# Altium schematic sheet FAN_IF.SchDoc
size A4; SheetNumber: 9; SheetTotal: 19
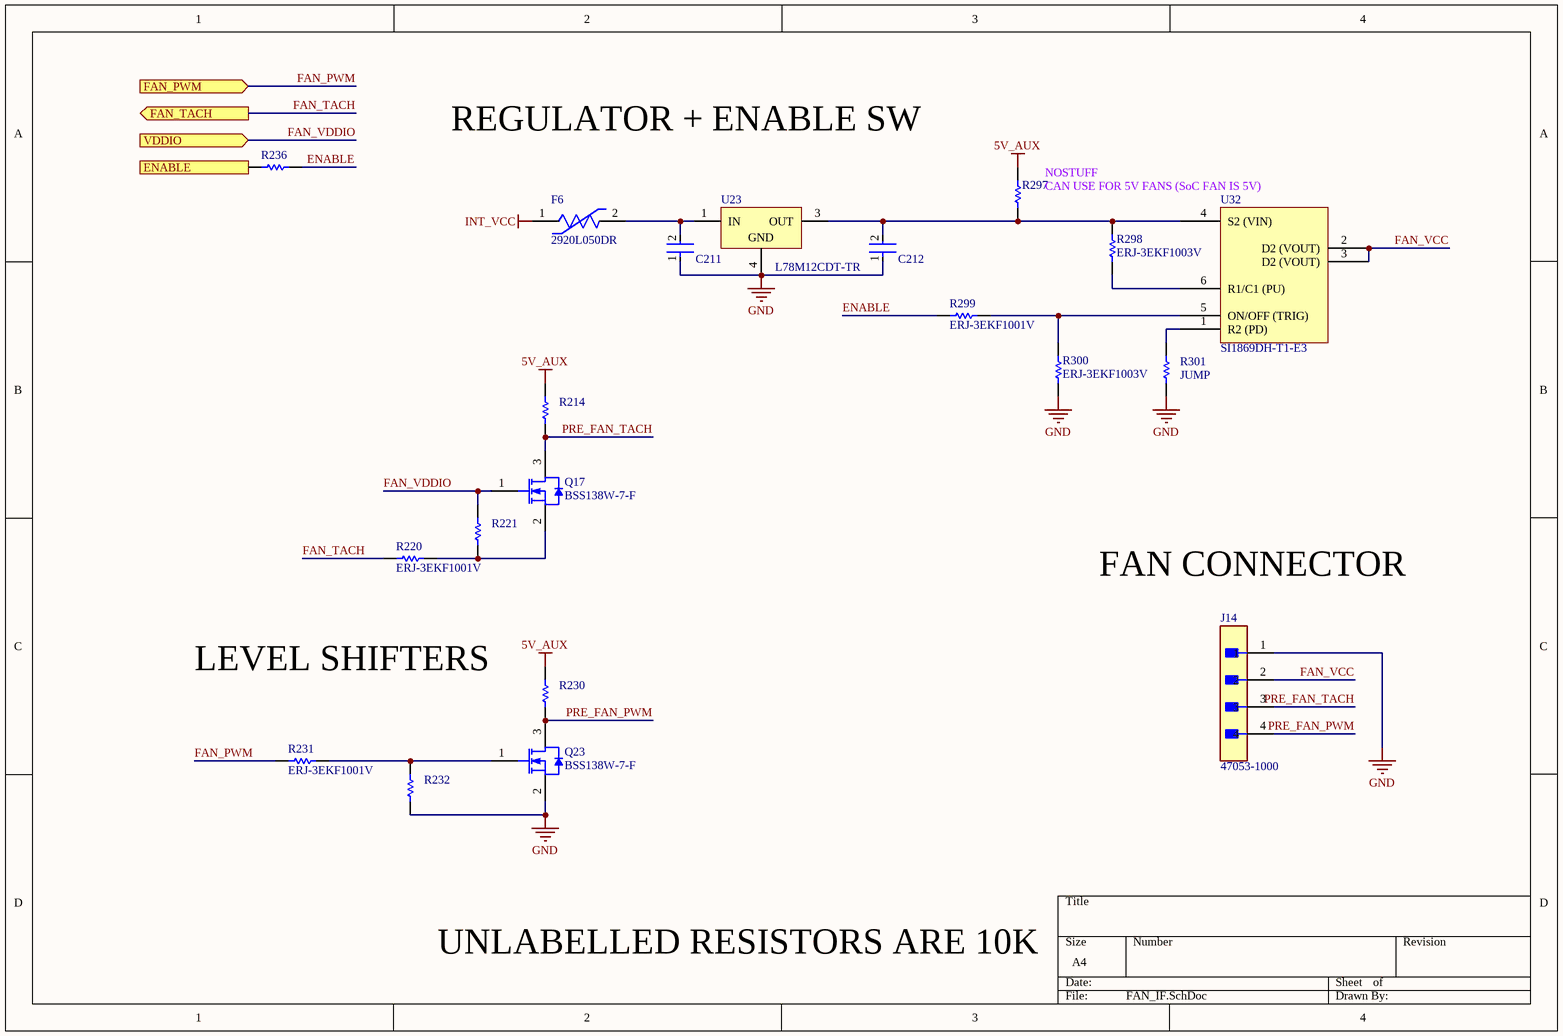
[diagram p0: FAN_IF.SchDoc]

## Parts
C211  C1005X7R1H104K050BB  [FP-C1005-050-0_05-IPC_C]  (value not drawn)
C212  C1005X7R1H104K050BB  [FP-C1005-050-0_05-IPC_C]  (value not drawn)
F6  2920L050DR  [FP-2920L050DR-MFG]
J14  47053-1000  [FP-470531000-MFG]
Q17  BSS138W-7-F  [DIOD-SOT323-3_V]
Q23  BSS138W-7-F  [DIOD-SOT323-3_V]
R214  ERJ3EKF1002V  [RESC1609X55X30LL15T15]  (value not drawn)
R220  ERJ-3EKF1001V  [RESC1608X55X30LL15T15]
R221  ERJ3EKF1002V  [RESC1609X55X30LL15T15]  (value not drawn)
R230  ERJ3EKF1002V  [RESC1609X55X30LL15T15]  (value not drawn)
R231  ERJ-3EKF1001V  [RESC1608X55X30LL15T15]
R232  ERJ3EKF1002V  [RESC1609X55X30LL15T15]  (value not drawn)
R236  0402 JUMPER  [RESC1005X40X25ML05T05]  (value not drawn)
R297  0402 JUMPER  [RESC1005X40X25ML05T05]  (value not drawn)
R298  ERJ-3EKF1003V  [RESC1608X55X30ML15T15]
R299  ERJ-3EKF1001V  [RESC1608X55X30LL15T15]
R300  ERJ-3EKF1003V  [RESC1608X55X30ML15T15]
R301  JUMP  [RESC1005X40X25ML05T05]
U23  L78M12CDT-TR  [TO-252_L]
U32  SI1869DH-T1-E3  [SOT65P242X110-6N]

## Ports
ENABLE (in, see VISION_BETA_EBB[4D]), FAN_PWM (in, see VISION_BETA_EBB[4D], STM32H730_PINOUT[8A]), FAN_TACH (out, see VISION_BETA_EBB[4D], STM32H730_PINOUT[8A]), VDDIO (in, see VISION_BETA_EBB[4D])

## Nets
5V_AUX: R214.1 R230.1 R297.2
GND: C211.1 C212.1 J14.1 Q23.2(S) R232.2 R300.1 R301.2 U23.4(GND)
INT_VCC: F6.1
ENABLE: R236.2 R299.1
ENABLE: R236.1 ; port ENABLE  [a separate net that carries the same name]
FAN_PWM: R231.1 ; port FAN_PWM
FAN_TACH: R220.1 ; port FAN_TACH
FAN_VCC: J14.2 U32.2(D2_(VOUT)) U32.3(D2_(VOUT))
FAN_VDDIO: Q17.1(G) R221.1 ; port VDDIO
PRE_FAN_PWM: J14.4 Q23.3(D) R230.2
PRE_FAN_TACH: J14.3 Q17.3(D) R214.2
NetC211_2: C211.2 F6.2 U23.1(IN)
NetC212_2: C212.2 R297.1 R298.2 U23.3(OUT) U32.4(S2_(VIN))
NetQ17_2: Q17.2(S) R220.2 R221.2
NetQ23_1: Q23.1(G) R231.2 R232.1
NetR298_1: R298.1 U32.6(R1/C1_(PU))
NetR299_2: R299.2 R300.2 U32.5(ON/OFF_(TRIG))
NetR301_1: R301.1 U32.1(R2_(PD))

## Notes on the sheet
- REGULATOR + ENABLE SW
- (near R297) NOSTUFF
- CAN USE FOR 5V FANS (SoC FAN IS 5V)
- FAN CONNECTOR
- LEVEL SHIFTERS
- UNLABELLED RESISTORS ARE 10K

## Library data of the parts
C211 C212 = CMP-2000-05393-2: Multilayer Ceramic Capacitors 100nF ±10% 50V X7R SMD 0402; Voltage: 50V; Dielectric Material: Ceramic; Min Operating Temperature: -55°C; Depth: 0.5mm; Radiation Hardening: No; RoHS Compliant: Yes; Voltage Rating (DC): 50V; Lead Free: Lead Free; Resistor Type: Ceramic; Height: 0.5mm; Dielectric: X7R; Thickness: 0.022inch; Case/Package: 0402; Case Code (Metric): 1005; Termination: SMD/SMT; Capacitance: 100nF; Packaging: Tape and Reel; Max Operating Temperature: 125°C; Mount: Surface Mount; Package Quantity: 1; Width: 0.02inch; Weight: 2.3E-05oz; Voltage Rating: 50V; Tolerance: 10%; Construction: Flat; Case Code (Imperial): 0402; Length: 1mm; REACH SVHC: No SVHC; Series: C
F6 = CMP-08606-000071-1: PTC RESET FUSE 60V 500MA 2920; Resistance: 1.4R; Trip Current: 1A; Power Dissipation: 1.5W; Time to Trip: 4s; Approvals: cULus; Current Rating: 10A; Operating Supply Voltage: 60V; Termination: SMD/SMT; Width: 5.44mm; Case/Package: 2920; Series: 2920L; Case Code (Imperial): 2920; Height: 1.25mm; Hold Current: 500mA; Terminal Material: Copper; Min Operating Temperature: -40°C; Package Quantity: 1500; Max Voltage Rating (DC): 60V; RoHS Compliant: Yes; Case Code (Metric): 7351; Lead Free: Lead Free; Max Operating Temperature: 85°C; Voltage Rating (DC): 60V; Working Voltage: 60V; Length: 7.98mm; REACH SVHC: No SVHC; Max Current Rating: 10A; Voltage Rating: 60V; Packaging: Tape and Reel
J14 = CMP-04776-000290-2: CONN HEADER VERT 4POS 2.54MM; NexarPartId: 854935; Manufacturer Lifecycle Status: ACTIVE; Voltage Rating (DC): 250V; Gender: Male; Plating: Copper; Number of Positions: 4; Glow Wire Compliant: Non-compliant; Current Rating: 500mA; Max Operating Temperature: 75°C; Number of Rows: 1; REACH SVHC: Unknown; Ambient Temperature Range High: 105°C; Pitch: 2.54mm; Height: 7.7mm; Min Operating Temperature: 0°C; Packaging: Bulk; Contact Material: Brass, Copper; Contact Plating: Tin; Lead Pitch: 2.54mm; Voltage Rating: 250V; Termination: Through Hole; Radiation Hardening: No; Orientation: Vertical; Mount: Through Hole; Number of Pins: 4; Country of Origin: HK; Halogen Free: Low Halogen; Lifecycle Status: Production; Number of Circuits: 4; Schedule B: 8536694040, 8536694040; Housing Color: Beige; Housing Material: Nylon; Depth: 5.84mm; RoHS: Compliant; Length: 10.2mm; Number of Contacts: 4
Q17 Q23 = CMP-2000-05968-1: N-Channel Enhancement Mode Mosfet, 50 V, 200 mA, -55 to 150 degC, 6-Pin SOT-323, RoHS, Tape and Reel; Typical Turn-Off Delay Time: 20ns; Number of Channels: 1Channel; Type: EnhancementModeFieldEffectTransistor; Brand: DiodesIncorporated; Vds - Drain-Source Breakdown Voltage: 75V; Vgs - Gate-Source Voltage: 20V; Rds On - Drain-Source Resistance: 1.4Ohms; Transistor Type: 1N-Channel; Configuration: Single; Unit Weight: 0.000212oz; Pd - Power Dissipation: 200mW; Id - Continuous Drain Current: 200mA; Forward Transconductance - Min: 0.1S; Manufacturer URL: http://www.diodes.com/; Series: BSS138; Package Description: 3-Pin Small Outline Transistor, Body 2 x 1.25 mm, Pitch 0.65 mm; Mounting Technology: SurfaceMount; Product Category: MOSFET; RoHS: True; Maximum Operating Temperature: +150C; Height: 1mm; Length: 2.2mm; Technology: Si; Width: 1.35mm; Datasheet URL: http://www.diodes.com/_files/datasheets/ds30206.pdf; Manufacturer: DiodesIncorporated; Package / Case: SOT-323-3; Typical Turn-On Delay Time: 20ns; Transistor Polarity: N-Channel; Factory Pack Quantity: 3000; Packaging: Reel; Product: MOSFETSmallSignal; Datasheet Version: Rev. 11-2, 09/2013; Package Reference: SOT323; Minimum Operating Temperature: -55C; Mounting Style: SMD/SMT; Channel Mode: Enhancement
R214 R221 R230 R232 = CMP-1012-00623-3: Chip Resistor, 10 KOhm, +/- 1%, 0.1 W, -55 to 155 degC, 0603 (1608 Metric), RoHS, Tape and Reel; Manufacturer: Panasonic; Voltage Rating: 75V; Case\/Package: 0603; Power Rating: 100mW; Resistance: 10KOhm; Temperature Coefficient: 100ppm\/degreesC; Number of Pins: 2; Package Reference: 603; Depth: 0.8mm; Mount: SurfaceMount; Package Description: 2-Pin Surface Mount Device, Body 1.6 x 0.85 mm; Datasheet Version: 02/2017; Length: 1.6mm; Lead Free: LeadFree; Height: 0.45mm; Number of Terminations: 2; Max Power Dissipation: 100mW; Min Operating Temperature: -55degC; Datasheet URL: https://industrial.panasonic.com/cdbs/www-data/pdf/RDA0000/AOA0000C304.pdf; Termination: SMD/SMT; Case Code (Metric): 1608; Case Code (Imperial): 0603; Tolerance: 1%; Max Operating Temperature: 155degC; RoHSCompliant: true; Voltage Rating (DC): 75V; Radiation Hardening: No; Packaging: TapeandReel; Composition: ThickFilm; Mounting Technology: SurfaceMount; Manufacturer URL: http://www.panasonic.com/; Width: 0.031inch; REACH SVHC: NoSVHC; Contact Plating: Tin; Military Standard: Not; Package Quantity: 1
R220 R231 R299 = CMP-2000-00180-1: Manufacturer: Panasonic; Part Number: ERJ-3EKF1001V
R236 R297 R301 = CMP-009-00118-2: READ THE NAME; Pins: 2; Component Type: Standard; Design Item ID: CMP-009-00206-2; Source: 0402jump.SchLib
R298 R300 = CMP-2000-00182-1: Manufacturer: Panasonic; Part Number: ERJ-3EKF1003V
U23 = CMP-0244-00204-1: Positive Voltage Regulator, 12V, 3-Pin DPAK, Tape and Reel; PackageDescription: 3-Pin Transistor Outline Package 2.28 mm Pitch, 9.7 mm Lead Span (DPAK); PackageVersion: 2011; PackageReference: TO-252; ComponentLink2URL: http://www.st.com/internet/com/TECHNICAL_RESOURCES/TECHNICAL_LITERATURE/DATASHEET/CD00000447.pdf; ComponentLink2Description: Datasheet; ComponentLink1URL: http://www.st.com; ComponentLink1Description: Manufacturer URL; DatasheetVersion: 1/11/2010
U32 = CMP-019-00043-2: Power Supply Support Circuit, Adjustable, 1 Channel, PDSO6; Max Supply Voltage: 20V; Min Supply Voltage: 1.8V; Case/Package: TSSOP; Pins: 6; RoHS Compliant: Yes